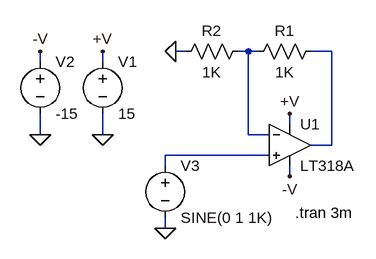
[diagram p0: schematic 318A.asc]
318A.asc, the LTspice schematic file:
Version 4
SHEET 1 896 680
WIRE -32 96 -48 96
WIRE 64 96 48 96
WIRE 80 96 64 96
WIRE 192 96 160 96
WIRE -256 112 -256 96
WIRE -160 112 -160 96
WIRE 128 208 128 192
WIRE -256 224 -256 192
WIRE -160 224 -160 192
WIRE 64 224 64 96
WIRE 96 224 64 224
WIRE 192 240 192 96
WIRE 192 240 160 240
WIRE 96 256 -64 256
WIRE -64 272 -64 256
WIRE 128 288 128 272
WIRE -64 368 -64 352
FLAG -160 224 0
FLAG 128 192 +V
FLAG -160 96 +V
FLAG 128 288 -V
FLAG -256 224 0
FLAG -256 96 -V
FLAG -48 96 0
FLAG -64 368 0
SYMBOL voltage -160 96 R0
SYMATTR InstName V1
SYMATTR Value 15
SYMBOL voltage -256 96 R0
SYMATTR InstName V2
SYMATTR Value -15
SYMBOL res 176 80 R90
WINDOW 0 0 56 VBottom 0
WINDOW 3 32 56 VTop 0
SYMATTR InstName R1
SYMATTR Value 1K
SYMBOL res 64 80 R90
WINDOW 0 0 56 VBottom 0
WINDOW 3 32 56 VTop 0
SYMATTR InstName R2
SYMATTR Value 1K
SYMBOL voltage -64 256 R0
SYMATTR InstName V3
SYMATTR Value SINE(0 1 1K)
SYMBOL opamps\\LT318A 128 240 R0
SYMATTR InstName U1
TEXT 136 344 Left 0 !.tran 3m

The netlist it stands for:
* 318A.asc
V1 +V 0 15
V2 -V 0 -15
R1 N002 N001 1K
R2 N001 0 1K
V3 N003 0 SINE(0 1 1K)
* U1: LT318A (symbol opamps\LT318A not available, pins judged from their places): In+=N003 In-=N001 V+=+V V-=-V OUT=N002
.tran 3m
.backanno
.end